# Altium schematic sheet Load.SchDoc
size A
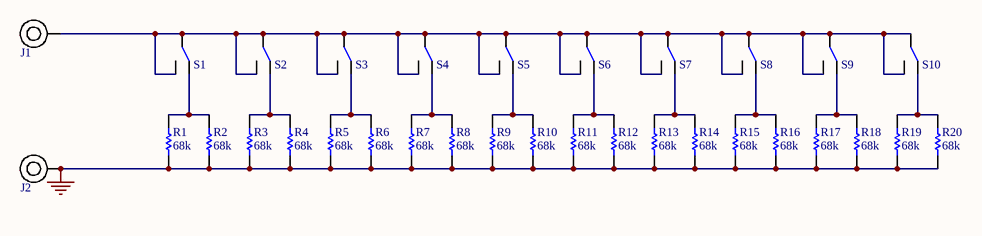
[diagram p0: Load.SchDoc]

## Parts
J1  575-8  [575-8]  (value not drawn)
J2  575-8  [575-8]  (value not drawn)
R1  68k  [KOA MOS1]
R2  68k  [KOA MOS1]
R3  68k  [KOA MOS1]
R4  68k  [KOA MOS1]
R5  68k  [KOA MOS1]
R6  68k  [KOA MOS1]
R7  68k  [KOA MOS1]
R8  68k  [KOA MOS1]
R9  68k  [KOA MOS1]
R10  68k  [KOA MOS1]
R11  68k  [KOA MOS1]
R12  68k  [KOA MOS1]
R13  68k  [KOA MOS1]
R14  68k  [KOA MOS1]
R15  68k  [KOA MOS1]
R16  68k  [KOA MOS1]
R17  68k  [KOA MOS1]
R18  68k  [KOA MOS1]
R19  68k  [KOA MOS1]
R20  68k  [KOA MOS1]
S1  OS102011MS2QN1  [OS102011MS2QN1]  (value not drawn)
S2  OS102011MS2QN1  [OS102011MS2QN1]  (value not drawn)
S3  OS102011MS2QN1  [OS102011MS2QN1]  (value not drawn)
S4  OS102011MS2QN1  [OS102011MS2QN1]  (value not drawn)
S5  OS102011MS2QN1  [OS102011MS2QN1]  (value not drawn)
S6  OS102011MS2QN1  [OS102011MS2QN1]  (value not drawn)
S7  OS102011MS2QN1  [OS102011MS2QN1]  (value not drawn)
S8  OS102011MS2QN1  [OS102011MS2QN1]  (value not drawn)
S9  OS102011MS2QN1  [OS102011MS2QN1]  (value not drawn)
S10  OS102011MS2QN1  [OS102011MS2QN1]  (value not drawn)

## Nets
GND: J2.1 R1.1 R2.1 R3.1 R4.1 R5.1 R6.1 R7.1 R8.1 R9.1 R10.1 R11.1 R12.1 R13.1 R14.1 R15.1 R16.1 R17.1 R18.1 R19.1 R20.1
NetJ1_1: J1.1 S1.2 S1.3 S2.2 S2.3 S3.2 S3.3 S4.2 S4.3 S5.2 S5.3 S6.2 S6.3 S7.2 S7.3 S8.2 S8.3 S9.2 S9.3 S10.2 S10.3
NetR1_2: R1.2 R2.2 S1.1
NetR3_2: R3.2 R4.2 S2.1
NetR5_2: R5.2 R6.2 S3.1
NetR7_2: R7.2 R8.2 S4.1
NetR9_2: R9.2 R10.2 S5.1
NetR11_2: R11.2 R12.2 S6.1
NetR13_2: R13.2 R14.2 S7.1
NetR15_2: R15.2 R16.2 S8.1
NetR17_2: R17.2 R18.2 S9.1
NetR19_2: R19.2 R20.2 S10.1

## Library data of the parts
J1 J2 = 575-8: Keystone PCB banana jack; Supplier 1: Digi-Key; Supplier 2: Mouser; Supplier Part Number 1: 36-575-8-ND; Supplier Part Number 2: 534-575-8
R1-R20 = MOS1CT528R683J: Metal Oxide Resistors 68K ohm 5% 1W; Manufacturer: KOA Speer; Manufacturer Part Number: MOS1CT52R183J; Temperature Coefficient: 300ppm/°C; Supplier 1: Mouser; Stock 1: 1404; Pricing 1: 1=0.1, 100=0.069, 500=0.058, 1000=0.052, 4000=0.046, 8000=0.04 (USD); Case/Package: Metal; Min Operating Temperature: -55°C; Max Operating Temperature: 200°C; Resistance: 68k; Tolerance: 5%; Power Rating: 1W; Packaging: Tape and Reel; Termination: Axial; Length: 9mm; Supplier Part Number 1: 660-MOS1CT528R683J; Package Quantity: 4000
S1-S10 = OS102011MS2QN1: SPDT slide switch; Manufacturer: ITT C&K; Mechanical Life: 10000Cycles; Actuator Material: Polyoxymethylene,Acetal,Polyacetal; Max Voltage Rating (DC): 12V; Max Current Rating: 100mA; Contact Resistance: 20mR; Contact Style: Non-Shorting; Insulation Resistance: 100MR; Switch Travel: 2mm; Switch Function: On-On; Actuator Type: Standard; Actuator Length: 4mm; Supplier 1: Digi-Key; Manufacturer Part Number: OS102011MS2QN1; Stock 1: 24998; Pricing 1: 1=0.46, 10=0.438, 25=0.4292, 50=0.3836, 100=0.3654, 250=0.35628, 500=0.30146, 1000=0.29232, 5000=0.25578 (USD); Mount: Through Hole,PCB; Contact Material: Copper Alloy,Brass,Silver; Contact Plating: Silver,Gold; Housing Material: Resin; Min Operating Temperature: -30°C; Max Operating Temperature: 70°C; Throw Configuration: SPDT; Termination: PC Pins; Packaging: Bulk; Electrical Life: 10000Cycles; Orientation: Vertical; Voltage Rating (DC): 12V; Package Quantity: 300; Contact Current Rating: 100mA; Current Rating: 100mA; Length: 8.6mm; Depth: 4.3mm; Radiation Hardening: No; REACH SVHC: No SVHC; Lead Free: Lead Free; ComponentLink1URL: http://www.farnell.com/datasheets/2674787.pdf?src-supplier=Element14; ComponentLink1Description: http://www.farnell.com/datasheets/2674787.pdf?src-supplier=Element14; ComponentLink2URL: https://www.ckswitches.com/media/1428/os.pdf?src-supplier=Digi-Key; ComponentLink2Description: https://www.ckswitches.com/media/1428/os.pdf?src-supplier=Digi-Key; ComponentLink3URL: http://uk.rs-online.com/webdocs/1263/0900766b81263f61.pdf?src-supplier=RSComponents; ComponentLink3Description: http://uk.rs-online.com/webdocs/1263/0900766b81263f61.pdf?src-supplier=RSComponents; ComponentLink4URL: http://www.farnell.com/datasheets/2674787.pdf?src-supplier=Newark; ComponentLink4Description: http://www.farnell.com/datasheets/2674787.pdf?src-supplier=Newark; ComponentLink5URL: https://www.verical.com/server-webapp/html/getDatasheet?partID=320490&src-supplier=Verical; ComponentLink5Description: https://www.verical.com/server-webapp/html/getDatasheet?partID=320490&src-supplier=Verical; ComponentLink6URL: https://www.alliedelec.com/m/d/08271ccc8b1809c6b911a7d3c93f3e8a.pdf?src-supplier=Allied+Electronics; ComponentLink6Description: https://www.alliedelec.com/m/d/08271ccc8b1809c6b911a7d3c93f3e8a.pdf?src-supplier=Allied+Electronics; ComponentLink7URL: http://www1.futureelectronics.com/doc/C%20&%20K%20COMPONENTS/OS102011MS2QN1.pdf?src-supplier=Future+Electronics; ComponentLink7Description: http://www1.futureelectronics.com/doc/C%20&%20K%20COMPONENTS/OS102011MS2QN1.pdf?src-supplier=Future+Electronics; Supplier 2: Mouser; Stock 2: 8188; Pricing 2: 1=0.39, 25=0.38, 50=0.344, 100=0.321, 250=0.29, 500=0.274 (USD); Supplier Part Number 2: 611-OS102011MS2QN1; Supplier Part Number 1: CKN9565-ND